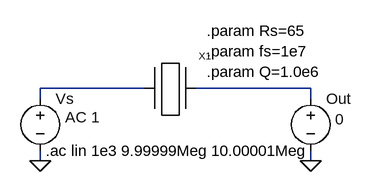
[diagram p0: schematic 04_CrystalModel_10MHz_0Z load_symbol_param.asc]
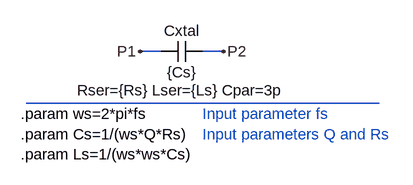
[diagram p1: sub-circuit xtal_param.asc]
04_CrystalModel_10MHz_0Z load_symbol_param.asc, the LTspice schematic file:
Version 4
SHEET 1 880 680
WIRE 160 272 0 272
WIRE 416 272 240 272
WIRE 0 288 0 272
WIRE 416 288 416 272
WIRE 0 384 0 368
WIRE 416 384 416 368
FLAG 0 384 0
FLAG 416 384 0
SYMBOL voltage 0 272 R0
WINDOW 123 38 45 Left 0
WINDOW 39 0 0 Left 0
SYMATTR Value2 AC 1
SYMATTR InstName Vs
SYMATTR Value ""
SYMBOL voltage 416 272 R0
WINDOW 123 0 0 Left 0
WINDOW 39 0 0 Left 0
WINDOW 3 38 48 Left 0
SYMATTR Value 0
SYMATTR InstName Out
SYMBOL xtal_param 160 304 R0
SYMATTR InstName X1
TEXT 8 368 Left 0 !.ac lin 1e3 9.99999Meg 10.00001Meg
TEXT 256 184 Left 0 !.param Rs=65\n.param fs=1e7\n.param Q=1.0e6

xtal_param.asc, the sub-circuit schematic file:
Version 4
SHEET 1 880 680
WIRE 176 144 144 144
WIRE 272 144 240 144
FLAG 144 144 P1
FLAG 272 144 P2
SYMBOL cap 240 128 R90
WINDOW 0 0 32 VBottom 0
WINDOW 3 32 32 VTop 0
WINDOW 39 60 32 VTop 0
SYMATTR InstName Cxtal
SYMATTR Value {Cs}
SYMATTR SpiceLine Rser={Rs} Lser={Ls} Cpar=3p
TEXT -40 240 Left 0 !.param ws=2*pi*fs\n.param Cs=1/(ws*Q*Rs)\n.param Ls=1/(ws*ws*Cs)
TEXT 240 240 Left 0 ;Input parameter fs\nInput parameters Q and Rs
LINE Normal 512 224 -32 224

The netlist it stands for:
* 04_CrystalModel_10MHz_0Z load_symbol_param.asc
Vs N001 0 AC 1
V§Out N002 0 0
XX1 N001 N002 xtal_param

* block symbol definitions
.subckt xtal_param P1 P2
Cxtal P2 P1 {Cs} Rser={Rs} Lser={Ls} Cpar=3p
.param ws=2*pi*fs
.param Cs=1/(ws*Q*Rs)
.param Ls=1/(ws*ws*Cs)
* Input parameter fs
* Input parameters Q and Rs
.ends xtal_param

.ac lin 1e3 9.99999Meg 10.00001Meg
.param Rs=65
.param fs=1e7
.param Q=1.0e6
.backanno
.end